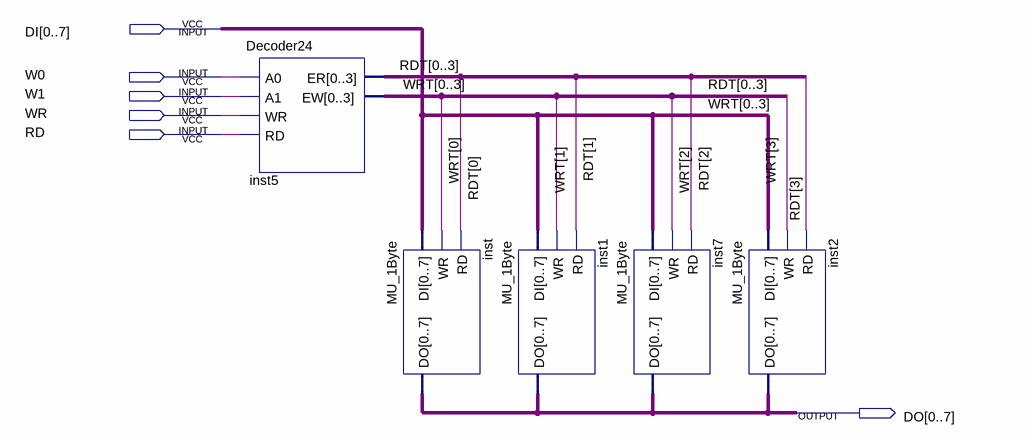
[diagram p0: schematic sheet]
// Quartus schematic MU_4Byte.bdf as structural Verilog: 5 symbols, 6 pins
module MU_4Byte (
  input  [0:7] DI,
  input  W0,
  input  W1,
  input  WR,
  input  RD,
  output [0:7] DO
);

  wire [3:0] RDT, WRT;

  Decoder24 inst5 (
    .A0(W0), .A1(W1), .WR(WR), .RD(RD), .ER({RDT[0], RDT[1], RDT[2], RDT[3]}),
    .EW({WRT[0], WRT[1], WRT[2], WRT[3]}));
  MU_1Byte inst (.DI(DI), .WR(WRT[0]), .RD(RDT[0]), .DO(DO));
  MU_1Byte inst1 (.DI(DI), .WR(WRT[1]), .RD(RDT[1]), .DO(DO));
  MU_1Byte inst7 (.DI(DI), .WR(WRT[2]), .RD(RDT[2]), .DO(DO));
  MU_1Byte inst2 (.DI(DI), .WR(WRT[3]), .RD(RDT[3]), .DO(DO));
endmodule
